# Altium schematic sheet dcdc.schdoc
size 209 x 297 mm; PageSetup: Record=PageOptions|CenterHorizontal=False|CenterVertical=False|PrintScale=0.95|XCorrection=0.00|YCorrection=0.00|PrintKind=1|BorderSize=5000000|LeftOffset=0|BottomOffset=0|Orientation=1|PaperLength=1000|PaperWidth=1000|Scale=100|PaperSource=15|PrintQuality=600|MediaType=1|DitherType=10|PaperKind=A4|PrintScaleMode=1
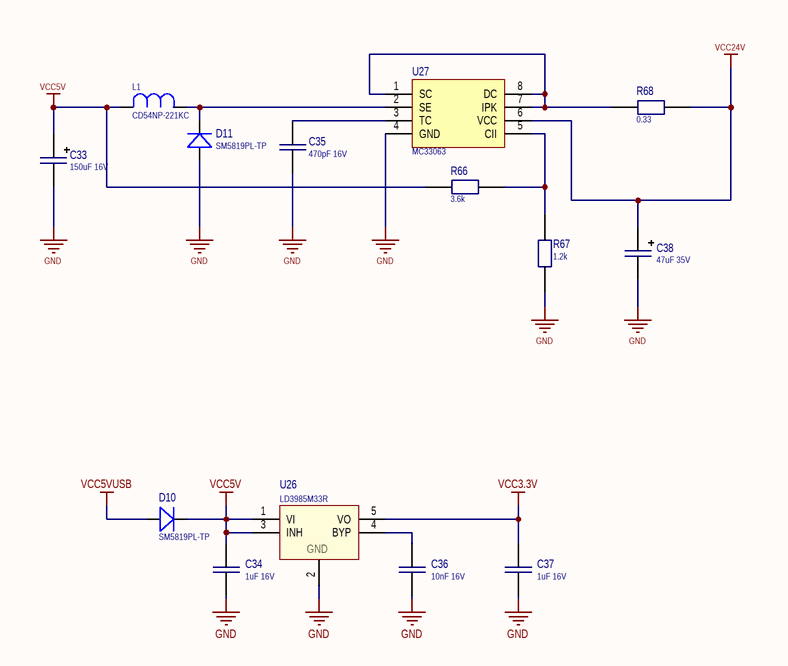
[diagram p0: dcdc.schdoc]

## Parts
C33  150uF 16V  [TANTAL_TYPE_D]
C34  1uF 16V  [C_0603]
C35  470pF 16V  [C_0603]
C36  10nF 16V  [C_0603]
C37  1uF 16V  [C_0603]
C38  47uF 35V  [TANTAL_TYPE_X]
D10  SM5819PL-TP  [SOD-123]
D11  SM5819PL-TP  [SOD-123]
L1  CD54NP-221KC  [CD54NP]
R66  3.6k  [R_0603]
R67  1.2k  [R_0603]
R68  0.33  [R_1206]
U26  LD3985M33R  [SOT23-5]
U27  MC33063  [SO-8]

## Nets
GND: C33.2 C34.1 C35.1 C36.1 C37.1 C38.2 D11.1(A) R67.1 U26.2(GND) U27.4(GND)
VCC3.3V: C37.2 U26.5(VO)
VCC5V: C33.1 C34.2 D10.2(K) L1.2 R66.1 U26.1(VI) U26.3(INH)
VCC5VUSB: D10.1(A)
VCC24V: C38.1 R68.1 U27.6(VCC)
NetC35_2: C35.2 U27.3(TC)
NetC36_2: C36.2 U26.4(BYP)
NetD11_2: D11.2(K) L1.1 U27.2(SE)
NetR66_2: R66.2 R67.2 U27.5(CII)
NetR68_2: R68.2 U27.1(SC) U27.7(IPK) U27.8(DC)

## Library data of the parts
C33 = TANTAL_CAP: Tantal Capacitor; Part Number: T491D157K016AT; Alternative Part: TAJD157K016RNJ; Value: 150uF 16V
C34 C37 = C0603: Capacitor; Part Number: CC0603KRX7R7BB105; Value: 1uF 16V
C35 = C0603: Capacitor; Part Number: CC0603KRX7R9BB471; Value: 470pF 16V
C36 = C0603: Capacitor; Part Number: CC0603JRX7R7BB103; Value: 10nF 16V
C38 = TANTAL_CAP: Tantal Capacitor; Part Number: T491X476K035AT; Alternative Part: *; Value: 47uF 35V
D10 D11 = D_SOD123: Diode; Part Number: SM5819PL-TP
L1 = L_CD54NP: Inductor; Alternative Part: SM5845-221MT; Value: CD54NP-221KC; Part Number: CD54NP-221KC
R66 = RES_SMD: Resistor; Part Number: RC0603FR-073K6L; Alternative Part: *; Value: 3.6k
R67 = RES_SMD: Resistor; Part Number: RC0603FR-071K2L; Alternative Part: *; Value: 1.2k
R68 = RES_SMD: Resistor; Part Number: RL1206FR-070R33L; Alternative Part: *; Value: 0.33
U26 = LD3985M33R: Ultra low drop and low noise BiCMOS voltage regulators; Part Number: LD3985M33R
U27 = MC33063: Step-up/down IC; Part Number: MC33063AP; Alternativr Part: *